# Altium project PCB_Project.PrjPcb (part 1 of 2)
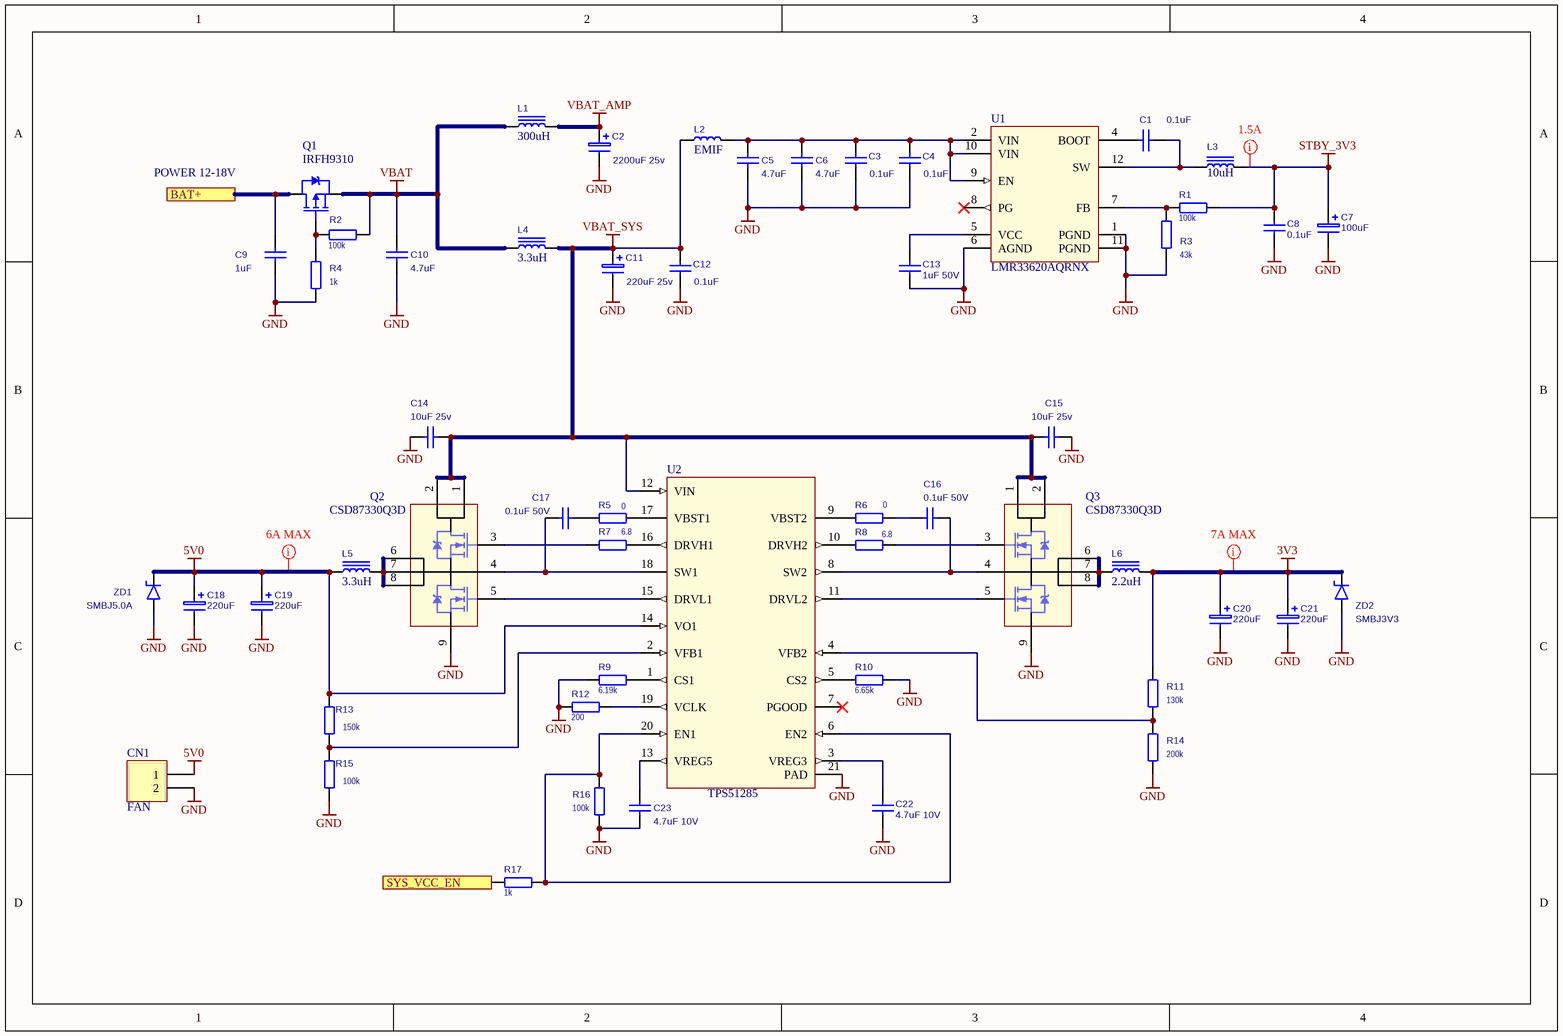
[diagram p0: power_supply.SchDoc]
8 sheets, 446 parts. Net scope: flat (ports and power ports of the same name join across sheets).
Board file: PCB.PcbDoc
Sheets:
  power_supply.SchDoc
  usb_main_connector.SchDoc
  core_module.SchDoc
  wifi_bluetooth.SchDoc
  video_in_gps_mems.SchDoc
  audio_in_dsp_radio.SchDoc
  power_amp.SchDoc
  display_dvd_connectors.SchDoc

## Sheet power_supply.SchDoc
size A4

### Parts
C1  value 0.1uF  [C0603]  (hidden comment: C1608X7R1H104K080AA)
C2  value 2200uF 25v  [R12H05]  (hidden comment: EEU-FC1V222)
C3  value 0.1uF  [C0603]  (hidden comment: C1608X7R1H104K080AA)
C4  value 0.1uF  [C0603]  (hidden comment: C1608X7R1H104K080AA)
C5  value 4.7uF  [C0603]  (hidden comment: GRM188R61E475KE11D)
C6  value 4.7uF  [C0603]  (hidden comment: GRM188R61E475KE11D)
C7  value 100uF  [TANTAL-B-1411]  (hidden comment: 6TPE100MPB)
C8  value 0.1uF  [C0603]  (hidden comment: C1608X7R1H104K080AA)
C9  value 1uF  [C0603]  (hidden comment: CC0603KRX7R9BB105)
C10  value 4.7uF  [C0603]  (hidden comment: GRM188R61E475KE11D)
C11  value 220uF 25v  [R08H04]  (hidden comment: ECAP 220/25V 0812 105'C)
C12  value 0.1uF  [C0603]  (hidden comment: C1608X7R1H104K080AA)
C13  value 1uF 50V  [C0603]  (hidden comment: CC0603KRX7R9BB105)
C14  value 10uF 25v  [C0805]  (hidden comment: GRM21BR61E106KA73L)
C15  value 10uF 25v  [C0805]  (hidden comment: GRM21BR61E106KA73L)
C16  value 0.1uF 50V  [C0603]  (hidden comment: C1608X7R1H104K080AA)
C17  value 0.1uF 50V  [C0603]  (hidden comment: C1608X7R1H104K080AA)
C18  value 220uF  [TANTAL-D-2916]  (hidden comment: 6TPE220MI)
C19  value 220uF  [TANTAL-D-2916]  (hidden comment: 6TPE220MI)
C20  value 220uF  [TANTAL-D-2916]  (hidden comment: 6TPE220MI)
C21  value 220uF  [TANTAL-D-2916]  (hidden comment: 6TPE220MI)
C22  value 4.7uF 10V  [C0603]  (hidden comment: CL10A475KP8NNNC)
C23  value 4.7uF 10V  [C0603]  (hidden comment: CL10A475KP8NNNC)
CN1  FAN  [MW-2M]
L1  value 300uH  [IND_COIL_TH_33x18]  (hidden comment: ATCA-06-301M)
L2  value EMIF  [IND0805]  (hidden comment: BLM21PG221SN1D)
L3  value 10uH  [CDRH6D28]  (hidden comment: CDRH6D38NP-100NC)
L4  value 3.3uH  [IHLP-2525CZ]  (hidden comment: IHLP2525CZER3R3M01)
L5  value 3.3uH  [IHLP-2525CZ]  (hidden comment: IHLP2525CZER3R3M01)
L6  value 2.2uH  [IHLP-2525CZ]  (hidden comment: IHLP2525CZER2R2M01)
Q1  IRFH9310  [PQFN_5X6]
Q2  CSD87330Q3D  [SON-8-3.3X3.3]
Q3  CSD87330Q3D  [SON-8-3.3X3.3]
R1  100k  [R0603]
R2  100k  [R0603]
R3  43k  [R0603]
R4  1k  [R0603]
R5  0  [R0603]
R6  0  [R0603]
R7  value 6.8  [R0603]  (hidden comment: RES 0603 6R8 5%)
R8  value 6.8  [R0603]  (hidden comment: RES 0603 6R8 5%)
R9  6.19k  [R0603]
R10  6.65k  [R0603]
R11  130k  [R0603]
R12  200  [R0603]
R13  150k  [R0603]
R14  200k  [R0603]
R15  100k  [R0603]
R16  100k  [R0603]
R17  1k  [R0603]
U1  LMR33620AQRNX  [VQFN-HR-12]
U2  TPS51285  [WQFN-20]
ZD1  value SMBJ5.0A  [SMB]  (hidden comment: SMBJ5.0A-TR)
ZD2  SMBJ3V3  [SMB]

### Ports
BAT+, SYS_VCC_EN

### Nets
3V3: C20.1(+) C21.1(+) L6.2 R11.1 ZD2.2(K)
5V0: C18.1(+) C19.1(+) CN1.1 L5.1 R13.1 U2.14(VO1) ZD1.2(K)
GND: C2.2(-) C3.2 C4.2 C5.1 C6.1 C7.2(-) C8.2 C9.1 C10.1 C11.2(-) C12.2 C13.1 C14.1 C15.2 C18.2(-) C19.2(-) C20.2(-) C21.2(-) C22.2 C23.2 CN1.2 Q2.9(GND) Q3.9(GND) R3.2 R4.2 R9.1 R10.2 R12.1 R14.2 R15.2 R16.1 U1.1(PGND) U1.6(AGND) U1.11(PGND) U2.21(PAD) ZD1.1(A) ZD2.1(A)
STBY_3V3: C7.1(+) C8.1 L3.2 R1.2
VBAT: C10.2 L1.1 L4.1 Q1.2(S) R2.2
VBAT_AMP: C2.1(+) L1.2
VBAT_SYS: C11.1(+) C12.1 C14.2 C15.1 L2.2 L4.2 Q2.1(VIN) Q2.2 Q3.1(VIN) Q3.2 U2.12(VIN)
BAT+: C9.2 Q1.3(D) ; port BAT+
SYS_VCC_EN: R17.1 ; port SYS_VCC_EN
NetC1_1: C1.1 L3.1 U1.12(SW)
NetC1_2: C1.2 U1.4(BOOT)
NetC3_1: C3.1 C4.1 C5.2 C6.2 L2.1 U1.2(VIN) U1.9(EN) U1.10(VIN)
NetC13_2: C13.2 U1.5(VCC)
NetC16_1: C16.1 R6.1
NetC16_2: C16.2 Q3.4(TGR) U2.8(SW2)
NetC17_1: C17.1 R5.1
NetC17_2: C17.2 Q2.4(TGR) U2.18(SW1)
NetC22_1: C22.1 U2.3(VREG3)
NetC23_1: C23.1 U2.13(VREG5)
NetL5_2: L5.2 Q2.6(VSW) Q2.7(VSW) Q2.8(VSW)
NetL6_1: L6.1 Q3.6(VSW) Q3.7(VSW) Q3.8(VSW)
NetQ1_1: Q1.1(G) R2.1 R4.1
NetQ2_3: Q2.3(TG) R7.1
NetQ2_5: Q2.5(BG) U2.15(DRVL1)
NetQ3_3: Q3.3(TG) R8.1
NetQ3_5: Q3.5(BG) U2.11(DRVL2)
NetR1_1: R1.1 R3.1 U1.7(FB)
NetR5_2: R5.2 U2.17(VBST1)
NetR6_2: R6.2 U2.9(VBST2)
NetR7_2: R7.2 U2.16(DRVH1)
NetR8_2: R8.2 U2.10(DRVH2)
NetR9_2: R9.2 U2.1(CS1)
NetR10_1: R10.1 U2.5(CS2)
NetR11_2: R11.2 R14.1 U2.4(VFB2)
NetR12_2: R12.2 U2.19(VCLK)
NetR13_2: R13.2 R15.1 U2.2(VFB1)
NetR16_2: R16.2 R17.2 U2.6(EN2) U2.20(EN1)

Not connected (* = marked no-connect by the designer): U1 8(PG)*; U2 7(PGOOD)*

### Layout directives
mark named 1.5A: STBY_3V3
mark named 6A MAX: 5V0
mark named 7A MAX: 3V3

### Notes on the sheet
- POWER 12-18V

### Library data of the parts
C1 C3-C6 C8-C10 C12-C17 C22 C23 = CAP_NPOL
C2 C7 C11 C18-C21 = CAP_POL
CN1 = HDR 2: Header, 2-Pin; LatestRevisionDate: 17-Jul-2002; LatestRevisionNote: Re-released for DXP Platform.; Publisher: Altium Limited
L1 L3-L6 = IND_W_IRON
L2 = IND_WO_IRON
Q1 = P-Channel: HEXFET Power MOSFET; Value: IRFH9310
Q2 Q3 = CSD87330Q3D: Synchronous Buck NexFET™ Power Block
R1-R17 = RESISTOR: RES
  R1 R2 R15 R16: Value: 100k
  R3: Value: 43k
  R4 R17: Value: 1k
  R5 R6: Value: 0
  R9: Value: 6.19k
  R10: Value: 6.65k
  R11: Value: 130k
  R12: Value: 200
  R13: Value: 150k
  R14: Value: 200k
U1 = LMR33620-Q1: 3.8-V to 36-V, 2-A Synchronous step-down voltage converter; value: TPS54232
U2 = TPS51285: Ultra-Low Quiescent (ULQ™) Dual Synchronous Step-Down Controller with / 5V and 3.3V LDOs; value: TPS53127RG
ZD1 ZD2 = ZENNER: Zenner diode
  ZD2: Value: SMBJ3V3

## Sheet usb_main_connector.SchDoc
size A3
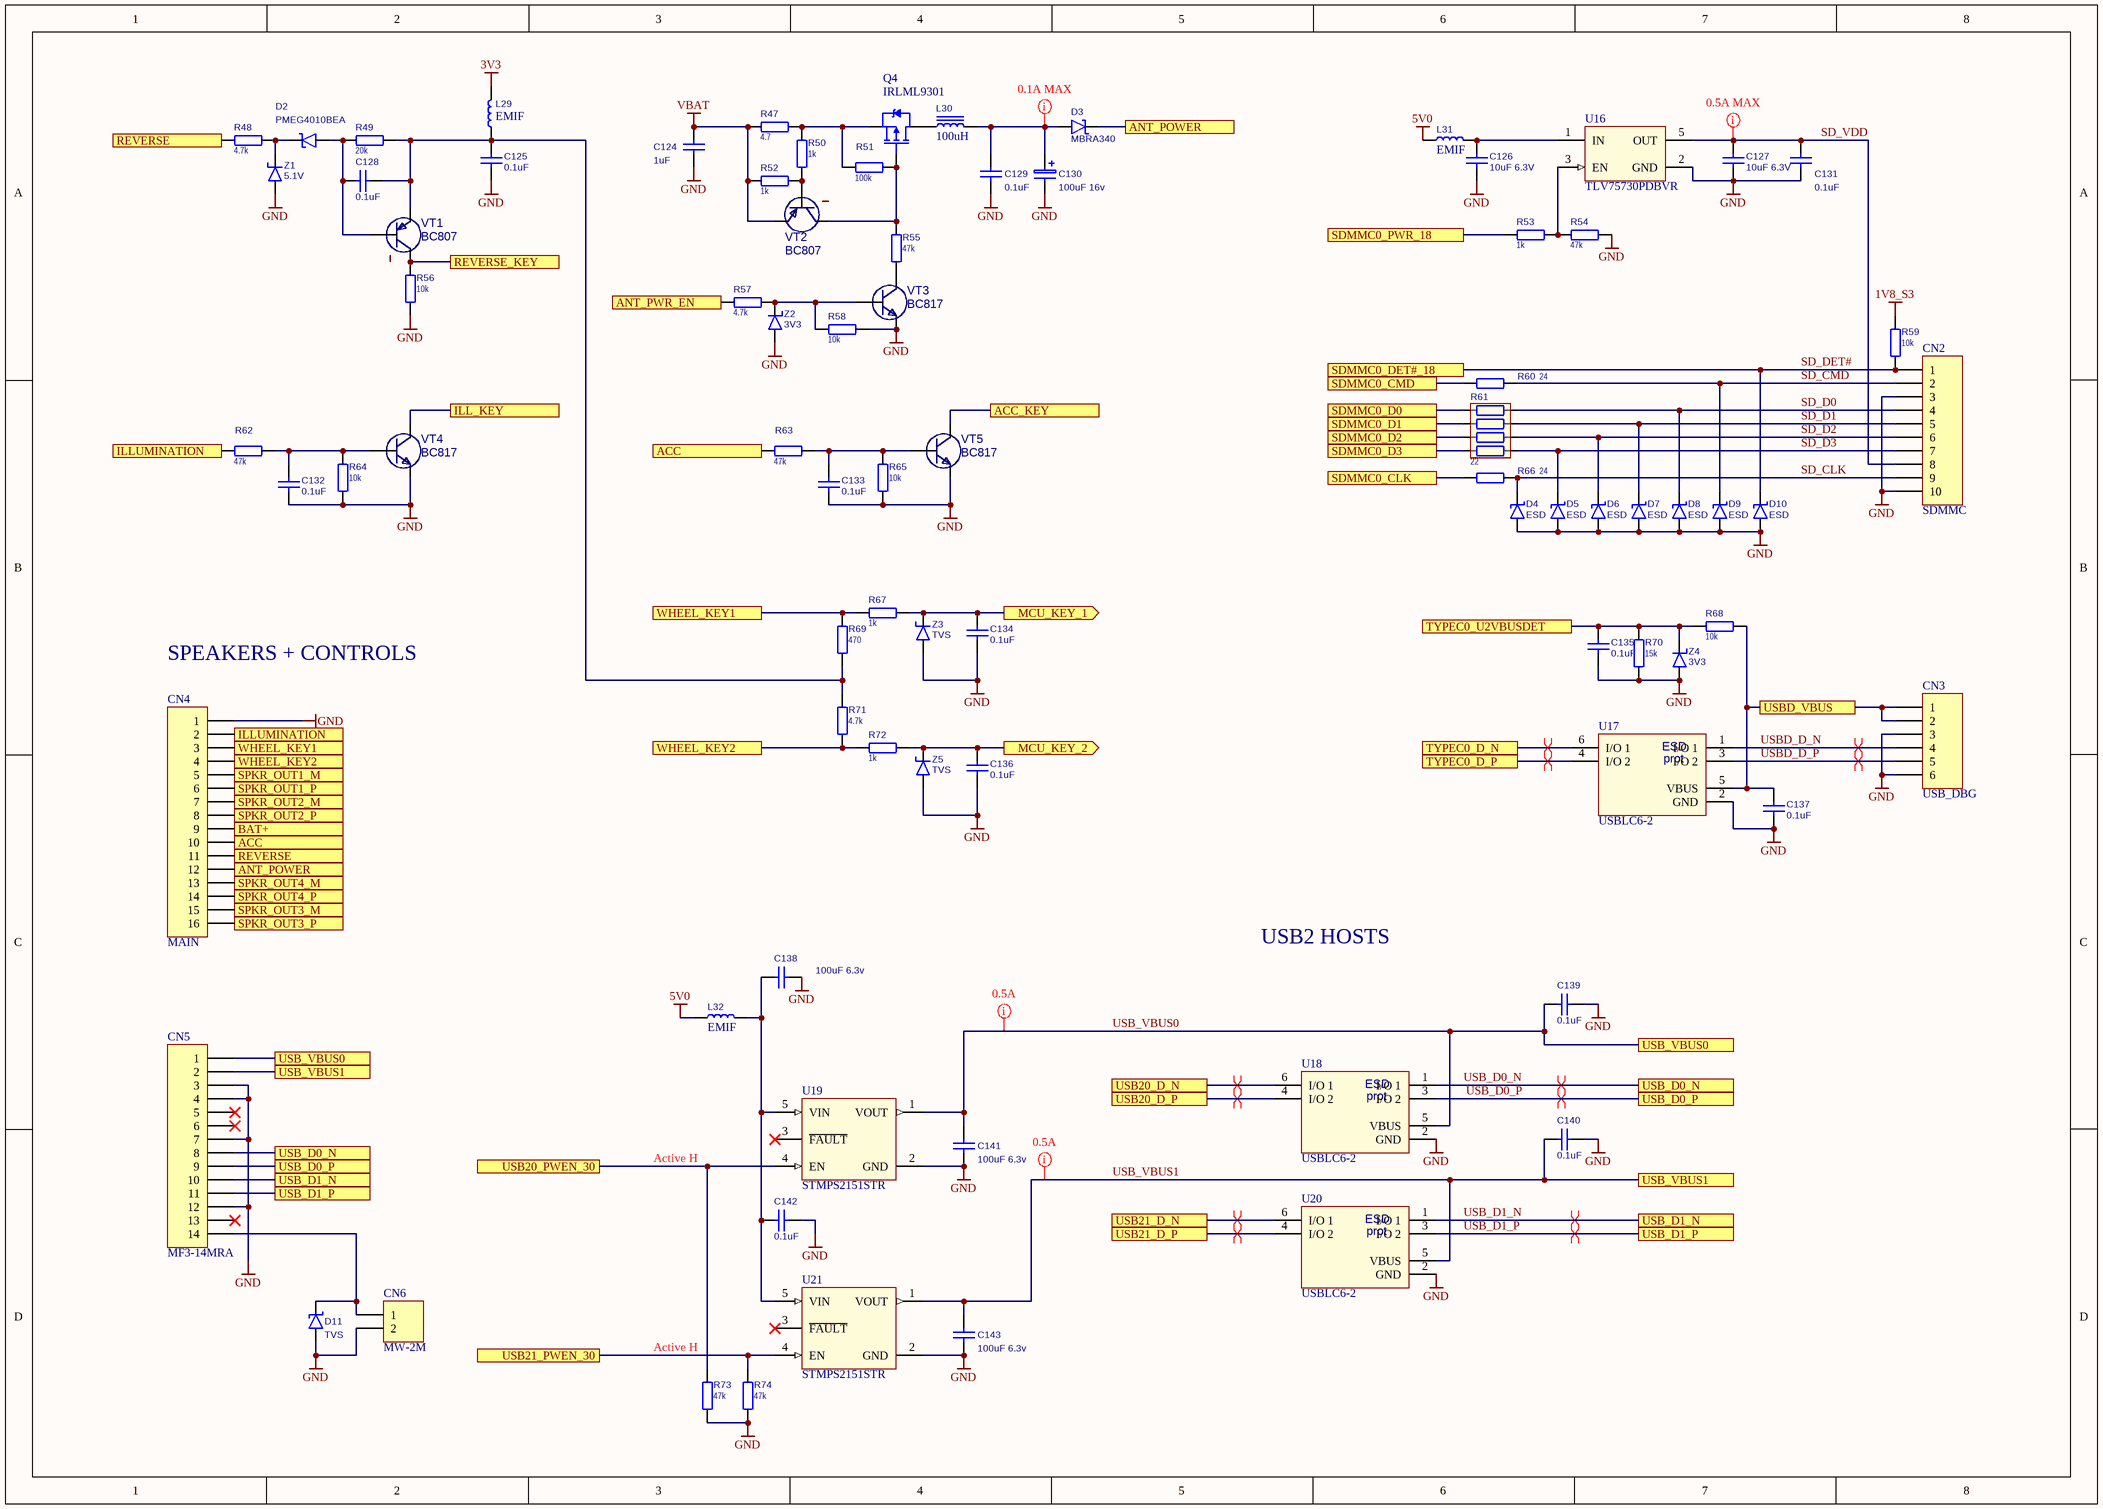
[diagram p1: usb_main_connector.SchDoc]

### Parts
C124  value 1uF  [C0603]  (hidden comment: CC0603KRX7R9BB105)
C125  value 0.1uF  [C0603]  (hidden comment: C1608X7R1H104K080AA)
C126  value 10uF 6.3V  [C0603]  (hidden comment: CC0603MRX5R5BB106)
C127  value 10uF 6.3V  [C0603]  (hidden comment: CC0603MRX5R5BB106)
C128  value 0.1uF  [C0603]  (hidden comment: C1608X7R1H104K080AA)
C129  value 0.1uF  [C0603]  (hidden comment: C1608X7R1H104K080AA)
C130  value 100uF 16v  [R05H11]  (hidden comment: ECAP 100/16V 0511 105'C)
C131  value 0.1uF  [C0603]  (hidden comment: C1608X7R1H104K080AA)
C132  value 0.1uF  [C0603]  (hidden comment: C1608X7R1H104K080AA)
C133  value 0.1uF  [C0603]  (hidden comment: C1608X7R1H104K080AA)
C134  value 0.1uF  [C0603]  (hidden comment: C1608X7R1H104K080AA)
C135  value 0.1uF  [C0603]  (hidden comment: C1608X7R1H104K080AA)
C136  value 0.1uF  [C0603]  (hidden comment: C1608X7R1H104K080AA)
C137  value 0.1uF  [C0603]  (hidden comment: C1608X7R1H104K080AA)
C138  value 100uF 6.3v  [C1206]  (hidden comment: CL31A107MQHNNNE)
C139  value 0.1uF  [C0603]  (hidden comment: C1608X7R1H104K080AA)
C140  value 0.1uF  [C0603]  (hidden comment: C1608X7R1H104K080AA)
C141  value 100uF 6.3v  [C1206]  (hidden comment: CL31A107MQHNNNE)
C142  value 0.1uF  [C0603]  (hidden comment: C1608X7R1H104K080AA)
C143  value 100uF 6.3v  [C1206]  (hidden comment: CL31A107MQHNNNE)
CN2  SDMMC  [10S-0.5SH]
CN3  USB_DBG  [6S-0.5SH]
CN4  MAIN  [43045-1600]
CN5  MF3-14MRA  [43045-1400]
CN6  MW-2M  [MW-2M]
D2  value PMEG4010BEA  [SOD-323]  (hidden comment: PMEG4010BEA.115)
D3  MBRA340  [SMA]
D4  value ESD  [SOD-923]  (hidden comment: TPD1E04U04)
D5  value ESD  [SOD-923]  (hidden comment: TPD1E04U04)
D6  value ESD  [SOD-923]  (hidden comment: TPD1E04U04)
D7  value ESD  [SOD-923]  (hidden comment: TPD1E04U04)
D8  value ESD  [SOD-923]  (hidden comment: TPD1E04U04)
D9  value ESD  [SOD-923]  (hidden comment: TPD1E04U04)
D10  value ESD  [SOD-923]  (hidden comment: TPD1E04U04)
D11  value TVS  [SOD-323]  (hidden comment: CDSOD323-T05LC)
L29  value EMIF  [IND0603]  (hidden comment: BLM18AG102SN1D)
L30  value 100uH  [CDRH4D28]  (hidden comment: CDRH4D28C/LDNP-101PC)
L31  value EMIF  [IND0603]  (hidden comment: BLM18AG102SN1D)
L32  value EMIF  [IND1206]  (hidden comment: BLM31PG391SN1L)
Q4  IRLML9301  [SOT-23-3]
R47  4.7  [R1206]
R48  4.7k  [R0603]
R49  20k  [R0603]
R50  1k  [R0603]
R51  100k  [R0603]
R52  1k  [R0603]
R53  1k  [R0603]
R54  47k  [R0603]
R55  47k  [R0603]
R56  10k  [R0603]
R57  4.7k  [R0603]
R58  10k  [R0603]
R59  10k  [R0603]
R60  24  [R0603]
R61  value 22  [R0804X4]  (hidden comment: TC124-JR-0722RL)
R62  47k  [R0603]
R63  47k  [R0603]
R64  10k  [R0603]
R65  10k  [R0603]
R66  24  [R0603]
R67  1k  [R0603]
R68  10k  [R0603]
R69  470  [R0603]
R70  15k  [R0603]
R71  4.7k  [R0603]
R72  1k  [R0603]
R73  value 47k  [R0603]  (hidden comment: 10k)
R74  value 47k  [R0603]  (hidden comment: 10k)
U16  TLV75730PDBVR  [SOT-23-5]
U17  USBLC6-2  [SOT-23-6]
U18  USBLC6-2  [SOT-23-6]
U19  STMPS2151STR  [SOT-23-5]
U20  USBLC6-2  [SOT-23-6]
U21  STMPS2151STR  [SOT-23-5]
VT1  BC807  [SOT-23-3]
VT2  BC807  [SOT-23-3]
VT3  BC817  [SOT-23-3]
VT4  BC817  [SOT-23-3]
VT5  BC817  [SOT-23-3]
Z1  value 5.1V  [SOD-323]  (hidden comment: BZX384-C5V1.115)
Z2  value 3V3  [SOD-323]  (hidden comment: BZX384-C3V3.115)
Z3  value TVS  [SOD-323]  (hidden comment: CDSOD323-T05LC)
Z4  value 3V3  [SOD-323]  (hidden comment: BZX384-C3V3.115)
Z5  value TVS  [SOD-323]  (hidden comment: CDSOD323-T05LC)

### Ports
ACC, ACC_KEY, ANT_POWER, ANT_PWR_EN, BAT+, ILL_KEY, ILLUMINATION, MCU_KEY_1 (out), MCU_KEY_2 (out), REVERSE, REVERSE_KEY, SDMMC0_CLK, SDMMC0_CMD, SDMMC0_D0, SDMMC0_D1, SDMMC0_D2, SDMMC0_D3, SDMMC0_DET#_18, SDMMC0_PWR_18, SPKR_OUT1_M, SPKR_OUT1_P, SPKR_OUT2_M, SPKR_OUT2_P, SPKR_OUT3_M, SPKR_OUT3_P, SPKR_OUT4_M, SPKR_OUT4_P, TYPEC0_D_N, TYPEC0_D_P, TYPEC0_U2VBUSDET, USB20_D_N, USB20_D_P, USB20_PWEN_30, USB21_D_N, USB21_D_P, USB21_PWEN_30, USB_D0_N, USB_D0_P, USB_D1_N, USB_D1_P, USB_VBUS0, USB_VBUS1, USBD_VBUS, WHEEL_KEY1, WHEEL_KEY2

### Nets
1V8_S3: R59.2
3V3: L29.2
5V0: L31.1 L32.2
GND: C124.1 C125.1 C126.2 C127.2 C129.1 C130.2(-) C131.1 C132.2 C133.2 C134.2 C135.2 C136.2 C137.2 C138.1 C139.2 C140.2 C141.1 C142.2 C143.1 CN2.3 CN2.10 CN3.3 CN3.6 CN4.1 CN5.3 CN5.4 CN5.7 CN5.12 CN6.2 D4.1(A) D5.1(A) D6.1(A) D7.1(A) D8.1(A) D9.1(A) D10.1(A) D11.1(A) R54.2 R56.2 R58.1 R64.1 R65.1 R70.1 R73.2 R74.2 U16.2(GND) U17.2(GND) U18.2(GND) U19.2(GND) U20.2(GND) U21.2(GND) VT3.2 VT4.2 VT5.2 Z1.1(A) Z2.1(A) Z3.1(A) Z4.1(A) Z5.1(A)
VBAT: C124.2 R47.2 R52.2 VT2.2(E)
ACC: CN4.10 R63.1 ; port ACC
ACC_KEY: VT5.3 ; port ACC_KEY
ANT_POWER: CN4.12 D3.2(K) ; port ANT_POWER
ANT_PWR_EN: R57.2 ; port ANT_PWR_EN
BAT+: CN4.9 ; port BAT+
ILL_KEY: VT4.3 ; port ILL_KEY
ILLUMINATION: CN4.2 R62.1 ; port ILLUMINATION
MCU_KEY_1: C134.1 R67.2 Z3.2(K) ; port MCU_KEY_1
MCU_KEY_2: C136.1 R72.2 Z5.2(K) ; port MCU_KEY_2
REVERSE: CN4.11 R48.1 ; port REVERSE
REVERSE_KEY: R56.1 VT1.3 ; port REVERSE_KEY
SD_CLK: CN2.9 D4.2(K) R66.1
SD_CMD: CN2.2 D9.2(K) R60.1
SD_D0: CN2.4 D8.2(K) R61.7
SD_D1: CN2.5 D7.2(K) R61.5
SD_D2: CN2.6 D6.2(K) R61.3
SD_D3: CN2.7 D5.2(K) R61.1
SD_DET#: CN2.1 D10.2(K) R59.1 ; port SDMMC0_DET#_18
SD_VDD: C127.1 C131.2 CN2.8 U16.5(OUT)
SDMMC0_CLK: R66.2 ; port SDMMC0_CLK
SDMMC0_CMD: R60.2 ; port SDMMC0_CMD
SDMMC0_D0: R61.8 ; port SDMMC0_D0
SDMMC0_D1: R61.6 ; port SDMMC0_D1
SDMMC0_D2: R61.4 ; port SDMMC0_D2
SDMMC0_D3: R61.2 ; port SDMMC0_D3
SDMMC0_PWR_18: R53.1 ; port SDMMC0_PWR_18
SPKR_OUT1_M: CN4.5 ; port SPKR_OUT1_M
SPKR_OUT1_P: CN4.6 ; port SPKR_OUT1_P
SPKR_OUT2_M: CN4.7 ; port SPKR_OUT2_M
SPKR_OUT2_P: CN4.8 ; port SPKR_OUT2_P
SPKR_OUT3_M: CN4.15 ; port SPKR_OUT3_M
SPKR_OUT3_P: CN4.16 ; port SPKR_OUT3_P
SPKR_OUT4_M: CN4.13 ; port SPKR_OUT4_M
SPKR_OUT4_P: CN4.14 ; port SPKR_OUT4_P
TYPEC0_D_N: U17.6(I/O_1) ; port TYPEC0_D_N
TYPEC0_D_P: U17.4(I/O_2) ; port TYPEC0_D_P
TYPEC0_U2VBUSDET: C135.1 R68.2 R70.2 Z4.2(K) ; port TYPEC0_U2VBUSDET
USB20_D_N: U18.6(I/O_1) ; port USB20_D_N
USB20_D_P: U18.4(I/O_2) ; port USB20_D_P
USB20_PWEN_30: R73.1 U19.4(EN) ; port USB20_PWEN_30
USB21_D_N: U20.6(I/O_1) ; port USB21_D_N
USB21_D_P: U20.4(I/O_2) ; port USB21_D_P
USB21_PWEN_30: R74.1 U21.4(EN) ; port USB21_PWEN_30
USB_D0_N: CN5.8 U18.1(I/O_1) ; port USB_D0_N
USB_D0_P: CN5.9 U18.3(I/O_2) ; port USB_D0_P
USB_D1_N: CN5.10 U20.1(I/O_1) ; port USB_D1_N
USB_D1_P: CN5.11 U20.3(I/O_2) ; port USB_D1_P
USB_VBUS0: C139.1 C141.2 CN5.1 U18.5(VBUS) U19.1(VOUT) ; port USB_VBUS0
USB_VBUS1: C140.1 C143.2 CN5.2 U20.5(VBUS) U21.1(VOUT) ; port USB_VBUS1
USBD_D_N: CN3.4 U17.1(I/O_1)
USBD_D_P: CN3.5 U17.3(I/O_2)
USBD_VBUS: C137.1 CN3.1 CN3.2 R68.1 U17.5(VBUS) ; port USBD_VBUS
WHEEL_KEY1: CN4.3 R67.1 R69.1 ; port WHEEL_KEY1
WHEEL_KEY2: CN4.4 R71.2 R72.1 ; port WHEEL_KEY2
NetC125_2: C125.2 C128.1 L29.1 R49.2 R69.2 R71.1 VT1.2
NetC126_1: C126.1 L31.2 U16.1(IN)
NetC128_2: C128.2 D2.1(A) R49.1 VT1.1
NetC129_2: C129.2 C130.1(+) D3.1(A) L30.2
NetC132_1: C132.1 R62.2 R64.2 VT4.1
NetC133_1: C133.1 R63.2 R65.2 VT5.1
NetC138_2: C138.2 C142.1 L32.1 U19.5(VIN) U21.5(VIN)
NetCN5_14: CN5.14 CN6.1 D11.2(K)
NetD2_2: D2.2(K) R48.2 Z1.2(K)
NetL30_1: L30.1 Q4.3(D)
NetQ4_1: Q4.1(G) R51.2 R55.2 VT2.3(K)
NetQ4_2: Q4.2(S) R47.1 R50.1 R51.1
NetR50_2: R50.2 R52.1 VT2.1(B)
NetR53_2: R53.2 R54.1 U16.3(EN)
NetR55_1: R55.1 VT3.3
NetR57_1: R57.1 R58.2 VT3.1 Z2.2(K)

Not connected (* = marked no-connect by the designer): CN5 5* 6* 13*; U19 3(~{FAULT})*; U21 3(~{FAULT})*

### Layout directives
mark named 0.1A MAX: NetC129_2
differential pair: TYPEC0_D_N, TYPEC0_D_P, USB20_D_N, USB20_D_P, USB21_D_N, USB21_D_P, USB_D0_N, USB_D0_P, USB_D1_N, USB_D1_P, USBD_D_N, USBD_D_P
mark named 0.5A: USB_VBUS0, USB_VBUS1
mark named 0.5A MAX: SD_VDD

### Notes on the sheet
- SPEAKERS + CONTROLS
- USB2 HOSTS
- Active H
- (near R73) Active H
- (in symbol USBLC6-2) ESD; prot

### Library data of the parts
C124-C129 C131-C143 = CAP_NPOL
C130 = CAP_POL
CN2 = HDR 10: Header, 10-Pin; LatestRevisionDate: 17-Jul-2002; LatestRevisionNote: Re-released for DXP Platform.; Publisher: Altium Limited
CN3 = HDR 6: Header, 6-Pin; LatestRevisionDate: 17-Jul-2002; LatestRevisionNote: Re-released for DXP Platform.; Publisher: Altium Limited
CN4 = HDR 16: Header, 16-Pin; LatestRevisionDate: 17-Jul-2002; LatestRevisionNote: Re-released for DXP Platform.; Publisher: Altium Limited
CN5 = HDR 14: Header, 14-Pin; LatestRevisionDate: 17-Jul-2002; LatestRevisionNote: Re-released for DXP Platform.; Publisher: Altium Limited
CN6 = HDR 2: Header, 2-Pin; LatestRevisionDate: 17-Jul-2002; LatestRevisionNote: Re-released for DXP Platform.; Publisher: Altium Limited
D2-D11 = SHOTTKY
  D3: Value: MBRA340
L29 L31 L32 = IND_WO_IRON
L30 = IND_W_IRON
Q4 = P-Channel: HEXFET Power MOSFET
R47-R60 R62-R74 = RESISTOR: RES
  R47: Value: 4.7
  R48 R57 R71: Value: 4.7k
  R49: Value: 20k
  R50 R52 R53 R67 R72: Value: 1k
  R51: Value: 100k
  R54 R55 R62 R63: Value: 47k
  R56 R58 R59 R64 R65 R68: Value: 10k
  R60 R66: Value: 24
  R69: Value: 470
  R70: Value: 15k
R61 = ARRAY
U16 = TLV733P: Capacitor-Free, 300-mA, Low-Dropout Regulator with Foldback Current Limit for Portable Devices; value: TLV733P
U17 U18 U20 = USBLC6-2: Ultralow capacitance ESD protection; value: USBLC6-2
U19 U21 = STMPS21x1STR: value: STMPS21x1STR
VT1 VT2 = P-N-P: Bipolar transistor P-N-P; Value: BC807
VT3-VT5 = N-P-N: Bipolar transistor N-P-N; Value: BC817
Z1-Z5 = ZENNER_1: ZENNER

## Sheet core_module.SchDoc
size A3
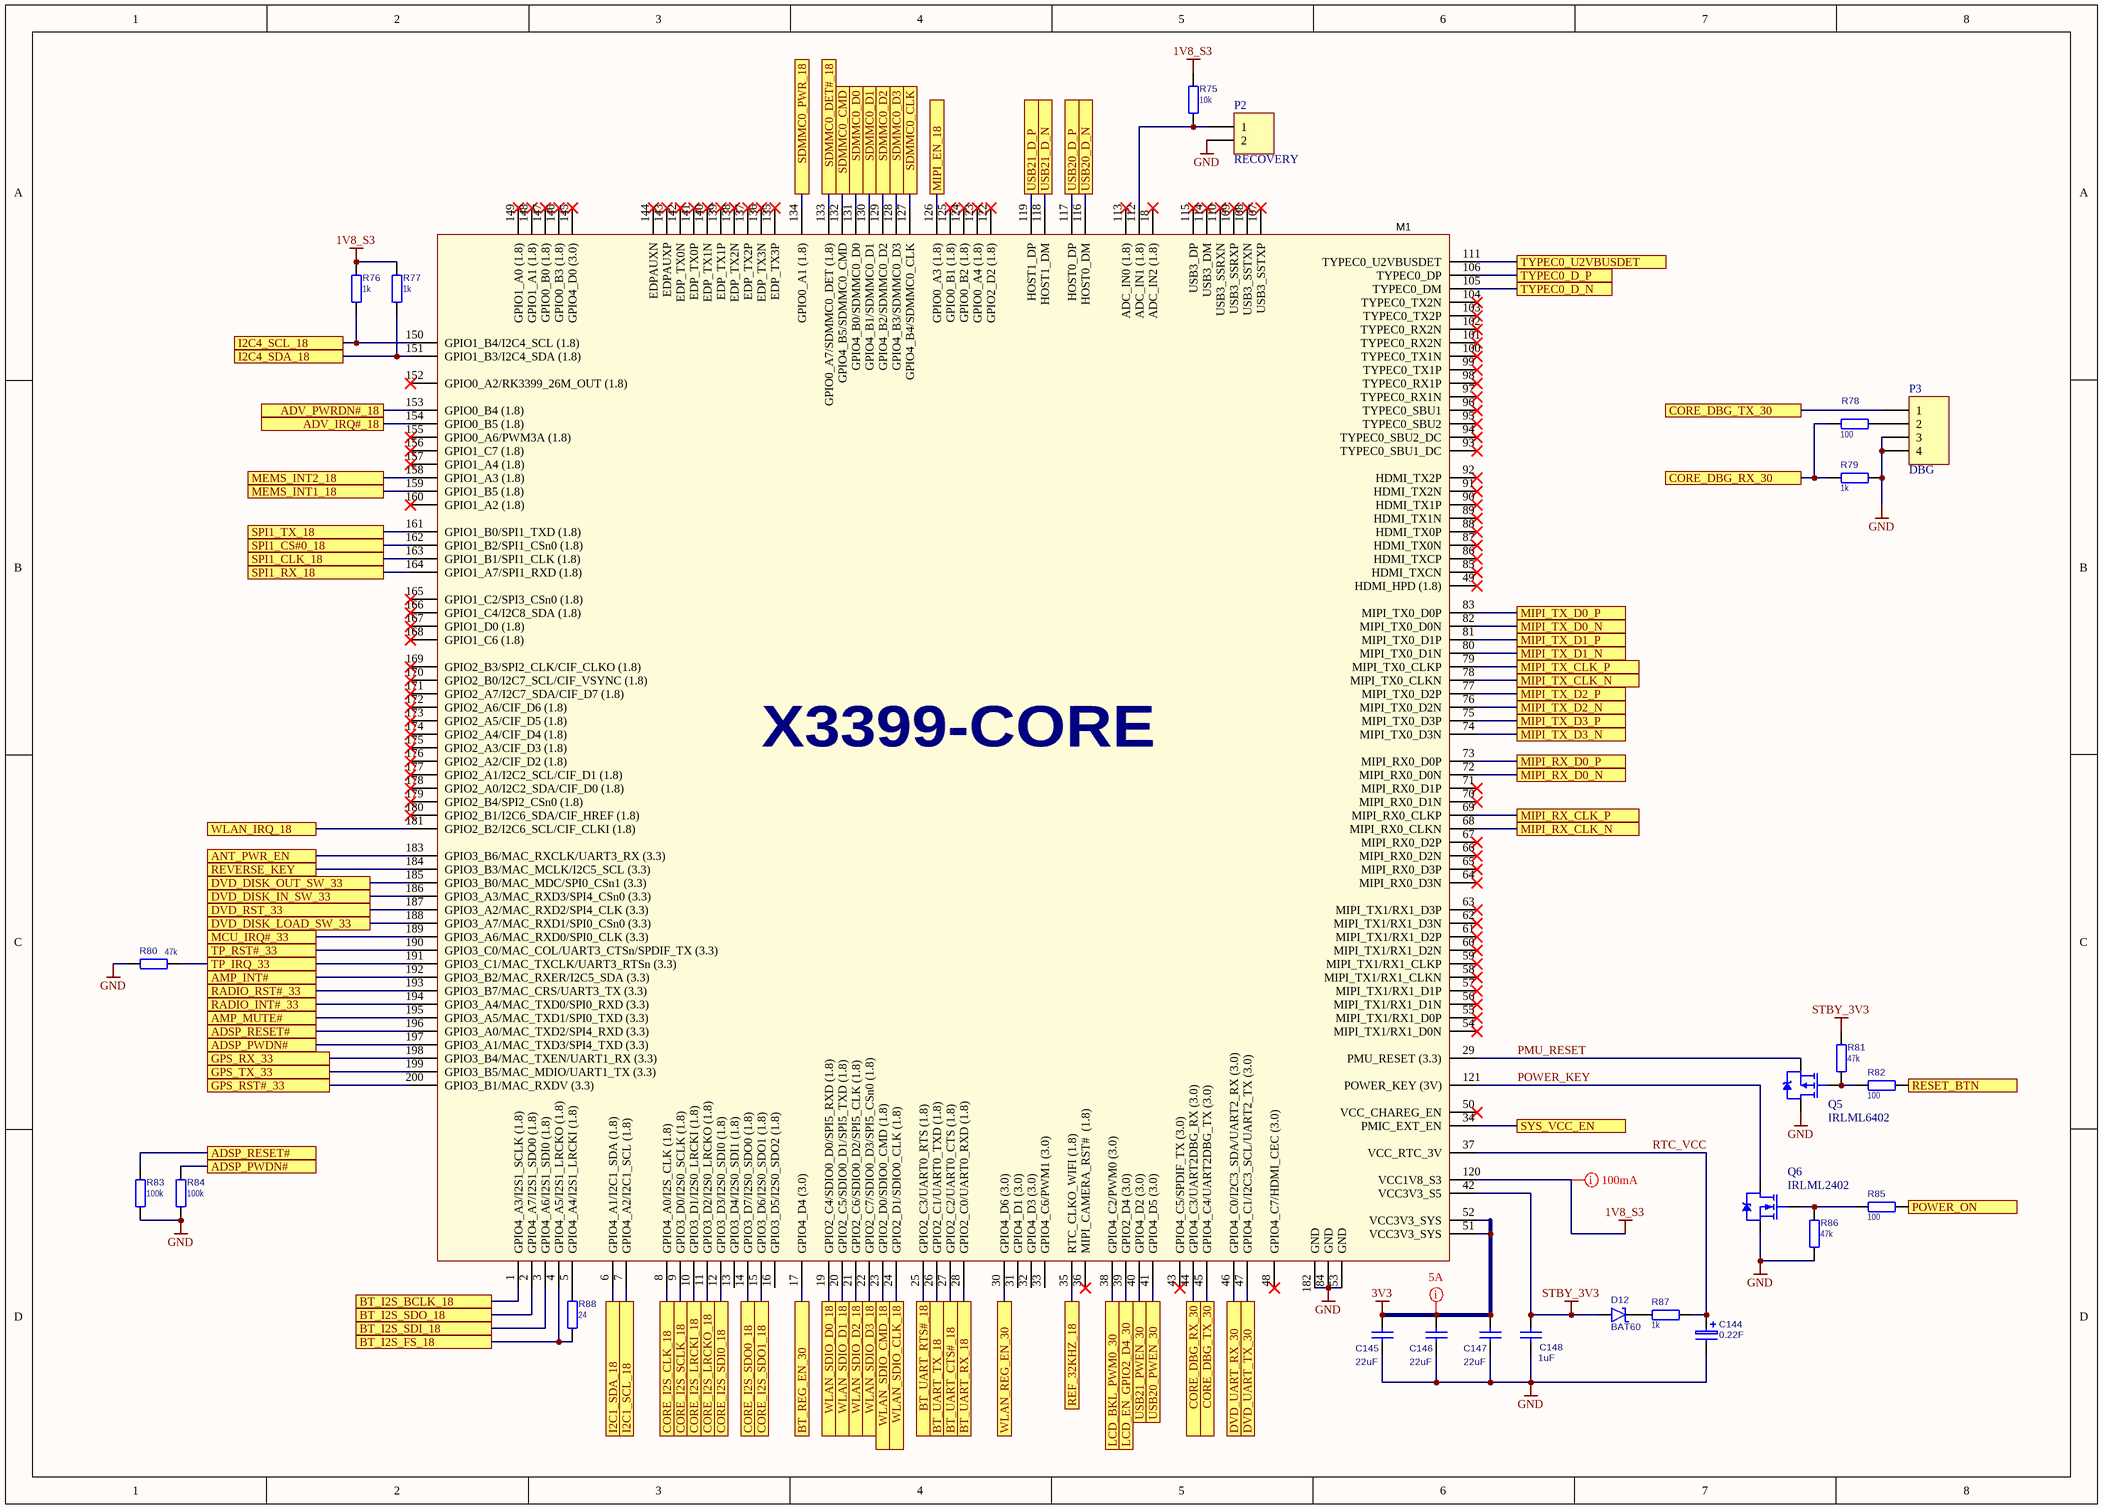
[diagram p2: core_module.SchDoc]

### Parts
C144  0.22F  [DS/DSK]
C145  value 22uF  [C0805]  (hidden comment: CL21A226MQQNNNE)
C146  value 22uF  [C0805]  (hidden comment: CL21A226MQQNNNE)
C147  value 22uF  [C0805]  (hidden comment: CL21A226MQQNNNE)
C148  value 1uF  [C0603]  (hidden comment: CC0603KRX7R9BB105)
D12  value BAT60  [SOD-323]  (hidden comment: BAT60AE6327HTSA1)
M1  X3399-CORE  [X3399-CORE]  (value not drawn)
P2  RECOVERY  [PLS-2]
P3  DBG  [PLD-2]
Q5  IRLML6402  [SOT-23-3]
Q6  IRLML2402  [SOT-23-3]
R75  10k  [R0603]
R76  1k  [R0603]
R77  1k  [R0603]
R78  100  [R0603]
R79  1k  [R0603]
R80  47k  [R0603]
R81  47k  [R0603]
R82  100  [R0603]
R83  100k  [R0603]
R84  100k  [R0603]
R85  100  [R0603]
R86  47k  [R0603]
R87  1k  [R0603]
R88  24  [R0603]

### Ports
ADSP_PWDN#, ADSP_RESET#, ADV_IRQ#_18, ADV_PWRDN#_18, AMP_INT#, AMP_MUTE#, ANT_PWR_EN, BT_I2S_BCLK_18, BT_I2S_FS_18, BT_I2S_SDI_18, BT_I2S_SDO_18, BT_REG_EN_30, BT_UART_CTS#_18, BT_UART_RTS#_18, BT_UART_RX_18, BT_UART_TX_18, CORE_DBG_RX_30, CORE_DBG_TX_30, CORE_I2S_CLK_18, CORE_I2S_LRCKI_18, CORE_I2S_LRCKO_18, CORE_I2S_SCLK_18, CORE_I2S_SDI0_18, CORE_I2S_SDO0_18, CORE_I2S_SDO1_18, DVD_DISK_IN_SW_33, DVD_DISK_LOAD_SW_33, DVD_DISK_OUT_SW_33, DVD_RST_33, DVD_UART_RX_30, DVD_UART_TX_30, GPS_RST#_33, GPS_RX_33, GPS_TX_33, I2C1_SCL_18, I2C1_SDA_18, I2C4_SCL_18, I2C4_SDA_18, LCD_BKL_PWM0_30, LCD_EN_GPIO2_D4_30, MCU_IRQ#_33, MEMS_INT1_18, MEMS_INT2_18, MIPI_EN_18, MIPI_RX_CLK_N, MIPI_RX_CLK_P, MIPI_RX_D0_N, MIPI_RX_D0_P, MIPI_TX_CLK_N, MIPI_TX_CLK_P, MIPI_TX_D0_N, MIPI_TX_D0_P, MIPI_TX_D1_N, MIPI_TX_D1_P, MIPI_TX_D2_N, MIPI_TX_D2_P, MIPI_TX_D3_N, MIPI_TX_D3_P, POWER_ON, RADIO_INT#_33, RADIO_RST#_33, REF_32KHZ_18, RESET_BTN, REVERSE_KEY, SDMMC0_CLK, SDMMC0_CMD, SDMMC0_D0, SDMMC0_D1, SDMMC0_D2, SDMMC0_D3, SDMMC0_DET#_18, SDMMC0_PWR_18, SPI1_CLK_18, SPI1_CS#0_18, SPI1_RX_18, SPI1_TX_18, SYS_VCC_EN, TP_IRQ_33, TP_RST#_33, TYPEC0_D_N, TYPEC0_D_P, TYPEC0_U2VBUSDET, USB20_D_N, USB20_D_P, USB20_PWEN_30, USB21_D_N, USB21_D_P, USB21_PWEN_30, WLAN_IRQ_18, WLAN_REG_EN_30, WLAN_SDIO_CLK_18, WLAN_SDIO_CMD_18, WLAN_SDIO_D0_18, WLAN_SDIO_D1_18, WLAN_SDIO_D2_18, WLAN_SDIO_D3_18

### Nets
1V8_S3: M1.120(VCC1V8_S3) R75.2 R76.2 R77.1
3V3: C145.1 C146.1 C147.1 M1.51(VCC3V3_SYS) M1.52(VCC3V3_SYS)
GND: C144.2(-) C145.2 C146.2 C147.2 C148.1 M1.53(GND) M1.84(GND) M1.182(GND) P2.2 P3.3 P3.4 Q5.3(D) Q6.2(S) R79.2 R80.1 R83.2 R84.2 R86.2
STBY_3V3: C148.2 D12.1(A) M1.42(VCC3V3_S5) R81.1
ADSP_PWDN#: M1.197(GPIO3_A1/MAC_TXD3/SPI4_TXD_(3.3)) R84.1 ; port ADSP_PWDN#
ADSP_RESET#: M1.196(GPIO3_A0/MAC_TXD2/SPI4_RXD_(3.3)) R83.1 ; port ADSP_RESET#
ADV_IRQ#_18: M1.154(GPIO0_B5_(1.8)) ; port ADV_IRQ#_18
ADV_PWRDN#_18: M1.153(GPIO0_B4_(1.8)) ; port ADV_PWRDN#_18
AMP_INT#: M1.192(GPIO3_B2/MAC_RXER/I2C5_SDA_(3.3)) ; port AMP_INT#
AMP_MUTE#: M1.195(GPIO3_A5/MAC_TXD1/SPI0_TXD_(3.3)) ; port AMP_MUTE#
ANT_PWR_EN: M1.183(GPIO3_B6/MAC_RXCLK/UART3_RX_(3.3)) ; port ANT_PWR_EN
BT_I2S_BCLK_18: M1.1(GPIO4_A3/I2S1_SCLK_(1.8)) ; port BT_I2S_BCLK_18
BT_I2S_FS_18: M1.4(GPIO4_A5/I2S1_LRCKO_(1.8)) R88.2 ; port BT_I2S_FS_18
BT_I2S_SDI_18: M1.3(GPIO4_A6/I2S1_SDI0_(1.8)) ; port BT_I2S_SDI_18
BT_I2S_SDO_18: M1.2(GPIO4_A7/I2S1_SDO0_(1.8)) ; port BT_I2S_SDO_18
BT_REG_EN_30: M1.17(GPIO4_D4_(3.0)) ; port BT_REG_EN_30
BT_UART_CTS#_18: M1.27(GPIO2_C2/UART0_CTS_(1.8)) ; port BT_UART_CTS#_18
BT_UART_RTS#_18: M1.25(GPIO2_C3/UART0_RTS_(1.8)) ; port BT_UART_RTS#_18
BT_UART_RX_18: M1.28(GPIO2_C0/UART0_RXD_(1.8)) ; port BT_UART_RX_18
BT_UART_TX_18: M1.26(GPIO2_C1/UART0_TXD_(1.8)) ; port BT_UART_TX_18
CORE_DBG_RX_30: M1.44(GPIO4_C3/UART2DBG_RX_(3.0)) R78.2 R79.1 ; port CORE_DBG_RX_30
CORE_DBG_TX_30: M1.45(GPIO4_C4/UART2DBG_TX_(3.0)) P3.1 ; port CORE_DBG_TX_30
CORE_I2S_CLK_18: M1.8(GPIO4_A0/I2S_CLK_(1.8)) ; port CORE_I2S_CLK_18
CORE_I2S_LRCKI_18: M1.10(GPIO3_D1/I2S0_LRCKI_(1.8)) ; port CORE_I2S_LRCKI_18
CORE_I2S_LRCKO_18: M1.11(GPIO3_D2/I2S0_LRCKO_(1.8)) ; port CORE_I2S_LRCKO_18
CORE_I2S_SCLK_18: M1.9(GPIO3_D0/I2S0_SCLK_(1.8)) ; port CORE_I2S_SCLK_18
CORE_I2S_SDI0_18: M1.12(GPIO3_D3/I2S0_SDI0_(1.8)) ; port CORE_I2S_SDI0_18
CORE_I2S_SDO0_18: M1.14(GPIO3_D7/I2S0_SDO0_(1.8)) ; port CORE_I2S_SDO0_18
CORE_I2S_SDO1_18: M1.15(GPIO3_D6/I2S0_SDO1_(1.8)) ; port CORE_I2S_SDO1_18
DVD_DISK_IN_SW_33: M1.186(GPIO3_A3/MAC_RXD3/SPI4_CSn0_(3.3)) ; port DVD_DISK_IN_SW_33
DVD_DISK_LOAD_SW_33: M1.188(GPIO3_A7/MAC_RXD1/SPI0_CSn0_(3.3)) ; port DVD_DISK_LOAD_SW_33
DVD_DISK_OUT_SW_33: M1.185(GPIO3_B0/MAC_MDC/SPI0_CSn1_(3.3)) ; port DVD_DISK_OUT_SW_33
DVD_RST_33: M1.187(GPIO3_A2/MAC_RXD2/SPI4_CLK_(3.3)) ; port DVD_RST_33
DVD_UART_RX_30: M1.46(GPIO4_C0/I2C3_SDA/UART2_RX_(3.0)) ; port DVD_UART_RX_30
DVD_UART_TX_30: M1.47(GPIO4_C1/I2C3_SCL/UART2_TX_(3.0)) ; port DVD_UART_TX_30
GPS_RST#_33: M1.200(GPIO3_B1/MAC_RXDV_(3.3)) ; port GPS_RST#_33
GPS_RX_33: M1.198(GPIO3_B4/MAC_TXEN/UART1_RX_(3.3)) ; port GPS_RX_33
GPS_TX_33: M1.199(GPIO3_B5/MAC_MDIO/UART1_TX_(3.3)) ; port GPS_TX_33
I2C1_SCL_18: M1.7(GPIO4_A2/I2C1_SCL_(1.8)) ; port I2C1_SCL_18
I2C1_SDA_18: M1.6(GPIO4_A1/I2C1_SDA_(1.8)) ; port I2C1_SDA_18
I2C4_SCL_18: M1.150(GPIO1_B4/I2C4_SCL_(1.8)) R76.1 ; port I2C4_SCL_18
I2C4_SDA_18: M1.151(GPIO1_B3/I2C4_SDA_(1.8)) R77.2 ; port I2C4_SDA_18
LCD_BKL_PWM0_30: M1.38(GPIO4_C2/PWM0_(3.0)) ; port LCD_BKL_PWM0_30
LCD_EN_GPIO2_D4_30: M1.39(GPIO2_D4_(3.0)) ; port LCD_EN_GPIO2_D4_30
MCU_IRQ#_33: M1.189(GPIO3_A6/MAC_RXD0/SPI0_CLK_(3.3)) ; port MCU_IRQ#_33
MEMS_INT1_18: M1.159(GPIO1_B5_(1.8)) ; port MEMS_INT1_18
MEMS_INT2_18: M1.158(GPIO1_A3_(1.8)) ; port MEMS_INT2_18
MIPI_EN_18: M1.126(GPIO0_A3_(1.8)) ; port MIPI_EN_18
MIPI_RX_CLK_N: M1.68(MIPI_RX0_CLKN) ; port MIPI_RX_CLK_N
MIPI_RX_CLK_P: M1.69(MIPI_RX0_CLKP) ; port MIPI_RX_CLK_P
MIPI_RX_D0_N: M1.72(MIPI_RX0_D0N) ; port MIPI_RX_D0_N
MIPI_RX_D0_P: M1.73(MIPI_RX0_D0P) ; port MIPI_RX_D0_P
MIPI_TX_CLK_N: M1.78(MIPI_TX0_CLKN) ; port MIPI_TX_CLK_N
MIPI_TX_CLK_P: M1.79(MIPI_TX0_CLKP) ; port MIPI_TX_CLK_P
MIPI_TX_D0_N: M1.82(MIPI_TX0_D0N) ; port MIPI_TX_D0_N
MIPI_TX_D0_P: M1.83(MIPI_TX0_D0P) ; port MIPI_TX_D0_P
MIPI_TX_D1_N: M1.80(MIPI_TX0_D1N) ; port MIPI_TX_D1_N
MIPI_TX_D1_P: M1.81(MIPI_TX0_D1P) ; port MIPI_TX_D1_P
MIPI_TX_D2_N: M1.76(MIPI_TX0_D2N) ; port MIPI_TX_D2_N
MIPI_TX_D2_P: M1.77(MIPI_TX0_D2P) ; port MIPI_TX_D2_P
MIPI_TX_D3_N: M1.74(MIPI_TX0_D3N) ; port MIPI_TX_D3_N
MIPI_TX_D3_P: M1.75(MIPI_TX0_D3P) ; port MIPI_TX_D3_P
PMU_RESET: M1.29(PMU_RESET_(3.3)) Q5.2(S)
POWER_KEY: M1.121(POWER_KEY_(3V)) Q6.3(D)
POWER_ON: R85.1 ; port POWER_ON
RADIO_INT#_33: M1.194(GPIO3_A4/MAC_TXD0/SPI0_RXD_(3.3)) ; port RADIO_INT#_33
RADIO_RST#_33: M1.193(GPIO3_B7/MAC_CRS/UART3_TX_(3.3)) ; port RADIO_RST#_33
REF_32KHZ_18: M1.35(RTC_CLKO_WIFI_(1.8)) ; port REF_32KHZ_18
RESET_BTN: R82.1 ; port RESET_BTN
REVERSE_KEY: M1.184(GPIO3_B3/MAC_MCLK/I2C5_SCL_(3.3)) ; port REVERSE_KEY
RTC_VCC: C144.1(+) M1.37(VCC_RTC_3V) R87.1
SD_DET#: M1.133(GPIO0_A7/SDMMC0_DET_(1.8)) ; port SDMMC0_DET#_18
SDMMC0_CLK: M1.127(GPIO4_B4/SDMMC0_CLK) ; port SDMMC0_CLK
SDMMC0_CMD: M1.132(GPIO4_B5/SDMMC0_CMD) ; port SDMMC0_CMD
SDMMC0_D0: M1.131(GPIO4_B0/SDMMC0_D0) ; port SDMMC0_D0
SDMMC0_D1: M1.130(GPIO4_B1/SDMMC0_D1) ; port SDMMC0_D1
SDMMC0_D2: M1.129(GPIO4_B2/SDMMC0_D2) ; port SDMMC0_D2
SDMMC0_D3: M1.128(GPIO4_B3/SDMMC0_D3) ; port SDMMC0_D3
SDMMC0_PWR_18: M1.134(GPIO0_A1_(1.8)) ; port SDMMC0_PWR_18
SPI1_CLK_18: M1.163(GPIO1_B1/SPI1_CLK_(1.8)) ; port SPI1_CLK_18
SPI1_CS#0_18: M1.162(GPIO1_B2/SPI1_CSn0_(1.8)) ; port SPI1_CS#0_18
SPI1_RX_18: M1.164(GPIO1_A7/SPI1_RXD_(1.8)) ; port SPI1_RX_18
SPI1_TX_18: M1.161(GPIO1_B0/SPI1_TXD_(1.8)) ; port SPI1_TX_18
SYS_VCC_EN: M1.34(PMIC_EXT_EN) ; port SYS_VCC_EN
TP_IRQ_33: M1.191(GPIO3_C1/MAC_TXCLK/UART3_RTSn_(3.3)) R80.2 ; port TP_IRQ_33
TP_RST#_33: M1.190(GPIO3_C0/MAC_COL/UART3_CTSn/SPDIF_TX_(3.3)) ; port TP_RST#_33
TYPEC0_D_N: M1.105(TYPEC0_DM) ; port TYPEC0_D_N
TYPEC0_D_P: M1.106(TYPEC0_DP) ; port TYPEC0_D_P
TYPEC0_U2VBUSDET: M1.111(TYPEC0_U2VBUSDET) ; port TYPEC0_U2VBUSDET
USB20_D_N: M1.116(HOST0_DM) ; port USB20_D_N
USB20_D_P: M1.117(HOST0_DP) ; port USB20_D_P
USB20_PWEN_30: M1.41(GPIO4_D5_(3.0)) ; port USB20_PWEN_30
USB21_D_N: M1.118(HOST1_DM) ; port USB21_D_N
USB21_D_P: M1.119(HOST1_DP) ; port USB21_D_P
USB21_PWEN_30: M1.40(GPIO4_D2_(3.0)) ; port USB21_PWEN_30
WLAN_IRQ_18: M1.181(GPIO2_B2/I2C6_SCL/CIF_CLKI_(1.8)) ; port WLAN_IRQ_18
WLAN_REG_EN_30: M1.30(GPIO4_D6_(3.0)) ; port WLAN_REG_EN_30
WLAN_SDIO_CLK_18: M1.24(GPIO2_D1/SDIO0_CLK_(1.8)) ; port WLAN_SDIO_CLK_18
WLAN_SDIO_CMD_18: M1.23(GPIO2_D0/SDIO0_CMD_(1.8)) ; port WLAN_SDIO_CMD_18
WLAN_SDIO_D0_18: M1.19(GPIO2_C4/SDIO0_D0/SPI5_RXD_(1.8)) ; port WLAN_SDIO_D0_18
WLAN_SDIO_D1_18: M1.20(GPIO2_C5/SDIO0_D1/SPI5_TXD_(1.8)) ; port WLAN_SDIO_D1_18
WLAN_SDIO_D2_18: M1.21(GPIO2_C6/SDIO0_D2/SPI5_CLK_(1.8)) ; port WLAN_SDIO_D2_18
WLAN_SDIO_D3_18: M1.22(GPIO2_C7/SDIO0_D3/SPI5_CSn0_(1.8)) ; port WLAN_SDIO_D3_18
NetD12_2: D12.2(K) R87.2
NetM1_5: M1.5(GPIO4_A4/I2S1_LRCKI_(1.8)) R88.1
NetM1_112: M1.112(ADC_IN1_(1.8)) P2.1 R75.1
NetP3_2: P3.2 R78.1
NetQ5_1: Q5.1(G) R81.2 R82.2
NetQ6_1: Q6.1(G) R85.2 R86.1

Not connected (* = marked no-connect by the designer): M1 13(GPIO3_D4/I2S0_SDI1_(1.8)) 16(GPIO3_D5/I2S0_SDO2_(1.8)) 18(ADC_IN2_(1.8))* 31(GPIO4_D1_(3.0)) 32(GPIO4_D3_(3.0)) 33(GPIO4_C6/PWM1_(3.0)) 36(MIPI_CAMERA_RST#__(1.8))* 43(GPIO4_C5/SPDIF_TX_(3.0))* 48(GPIO4_C7/HDMI_CEC_(3.0))* 49(HDMI_HPD_(1.8))* 50(VCC_CHAREG_EN)* 54(MIPI_TX1/RX1_D0N)* 55(MIPI_TX1/RX1_D0P)* 56(MIPI_TX1/RX1_D1N)* 57(MIPI_TX1/RX1_D1P)* 58(MIPI_TX1/RX1_CLKN)* 59(MIPI_TX1/RX1_CLKP)* 60(MIPI_TX1/RX1_D2N)* 61(MIPI_TX1/RX1_D2P)* 62(MIPI_TX1/RX1_D3N)* 63(MIPI_TX1/RX1_D3P)* 64(MIPI_RX0_D3N)* 65(MIPI_RX0_D3P)* 66(MIPI_RX0_D2N)* 67(MIPI_RX0_D2P)* 70(MIPI_RX0_D1N)* 71(MIPI_RX0_D1P)* 85(HDMI_TXCN)* 86(HDMI_TXCP)* 87(HDMI_TX0N)* 88(HDMI_TX0P)* 89(HDMI_TX1N)* 90(HDMI_TX1P)* 91(HDMI_TX2N)* 92(HDMI_TX2P)* 93(TYPEC0_SBU1_DC)* 94(TYPEC0_SBU2_DC)* 95(TYPEC0_SBU2)* 96(TYPEC0_SBU1)* 97(TYPEC0_RX1N)* 98(TYPEC0_RX1P)* 99(TYPEC0_TX1P)* 100(TYPEC0_TX1N)* 101(TYPEC0_RX2N)* 102(TYPEC0_RX2N)* 103(TYPEC0_TX2P)* 104(TYPEC0_TX2N)* 107(USB3_SSTXP)* 108(USB3_SSTXN)* 109(USB3_SSRXP)* 110(USB3_SSRXN)* 113(ADC_IN0_(1.8))* 114(USB3_DM)* 115(USB3_DP)* 122(GPIO2_D2_(1.8))* 123(GPIO0_A4_(1.8))* 124(GPIO0_B2_(1.8))* 125(GPIO0_B1_(1.8))* 135(EDP_TX3P)* 136(EDP_TX3N)* 137(EDP_TX2P)* 138(EDP_TX2N)* 139(EDP_TX1P)* 140(EDP_TX1N)* 141(EDP_TX0P)* 142(EDP_TX0N)* 143(EDPAUXP)* 144(EDPAUXN)* 145(GPIO4_D0_(3.0))* 146(GPIO0_B3_(1.8))* 147(GPIO0_B0_(1.8))* 148(GPIO1_A1_(1.8))* 149(GPIO1_A0_(1.8))* 152(GPIO0_A2/RK3399_26M_OUT_(1.8))* 155(GPIO0_A6/PWM3A_(1.8))* 156(GPIO1_C7_(1.8))* 157(GPIO1_A4_(1.8))* 160(GPIO1_A2_(1.8))* 165(GPIO1_C2/SPI3_CSn0_(1.8))* 166(GPIO1_C4/I2C8_SDA_(1.8))* 167(GPIO1_D0_(1.8))* 168(GPIO1_C6_(1.8))* 169(GPIO2_B3/SPI2_CLK/CIF_CLKO_(1.8))* 170(GPIO2_B0/I2C7_SCL/CIF_VSYNC_(1.8))* 171(GPIO2_A7/I2C7_SDA/CIF_D7_(1.8))* 172(GPIO2_A6/CIF_D6_(1.8))* 173(GPIO2_A5/CIF_D5_(1.8))* 174(GPIO2_A4/CIF_D4_(1.8))* 175(GPIO2_A3/CIF_D3_(1.8))* 176(GPIO2_A2/CIF_D2_(1.8))* 177(GPIO2_A1/I2C2_SCL/CIF_D1_(1.8))* 178(GPIO2_A0/I2C2_SDA/CIF_D0_(1.8))* 179(GPIO2_B4/SPI2_CSn0_(1.8))* 180(GPIO2_B1/I2C6_SDA/CIF_HREF_(1.8))*

### Layout directives
mark named 100mA: 1V8_S3
mark named 5A: 3V3

### Library data of the parts
C144 = CAP_POL: Value: 0.22F
C145-C148 = CAP_NPOL
D12 = SHOTTKY
M1 = X3399-CORE: RK3399 Six-Core 64-bit
P2 = HDR 2: Header, 2-Pin; LatestRevisionDate: 17-Jul-2002; LatestRevisionNote: Re-released for DXP Platform.; Publisher: Altium Limited
P3 = HDR 4: Header, 4-Pin; LatestRevisionDate: 17-Jul-2002; LatestRevisionNote: Re-released for DXP Platform.; Publisher: Altium Limited
Q5 = P-Channel: HEXFET Power MOSFET
Q6 = N-Channel: HEXFET Power MOSFET
R75-R88 = RESISTOR: RES
  R75: Value: 10k
  R76 R77 R79 R87: Value: 1k
  R78 R82 R85: Value: 100
  R80 R81 R86: Value: 47k
  R83 R84: Value: 100k
  R88: Value: 24

## Sheet wifi_bluetooth.SchDoc
size A4
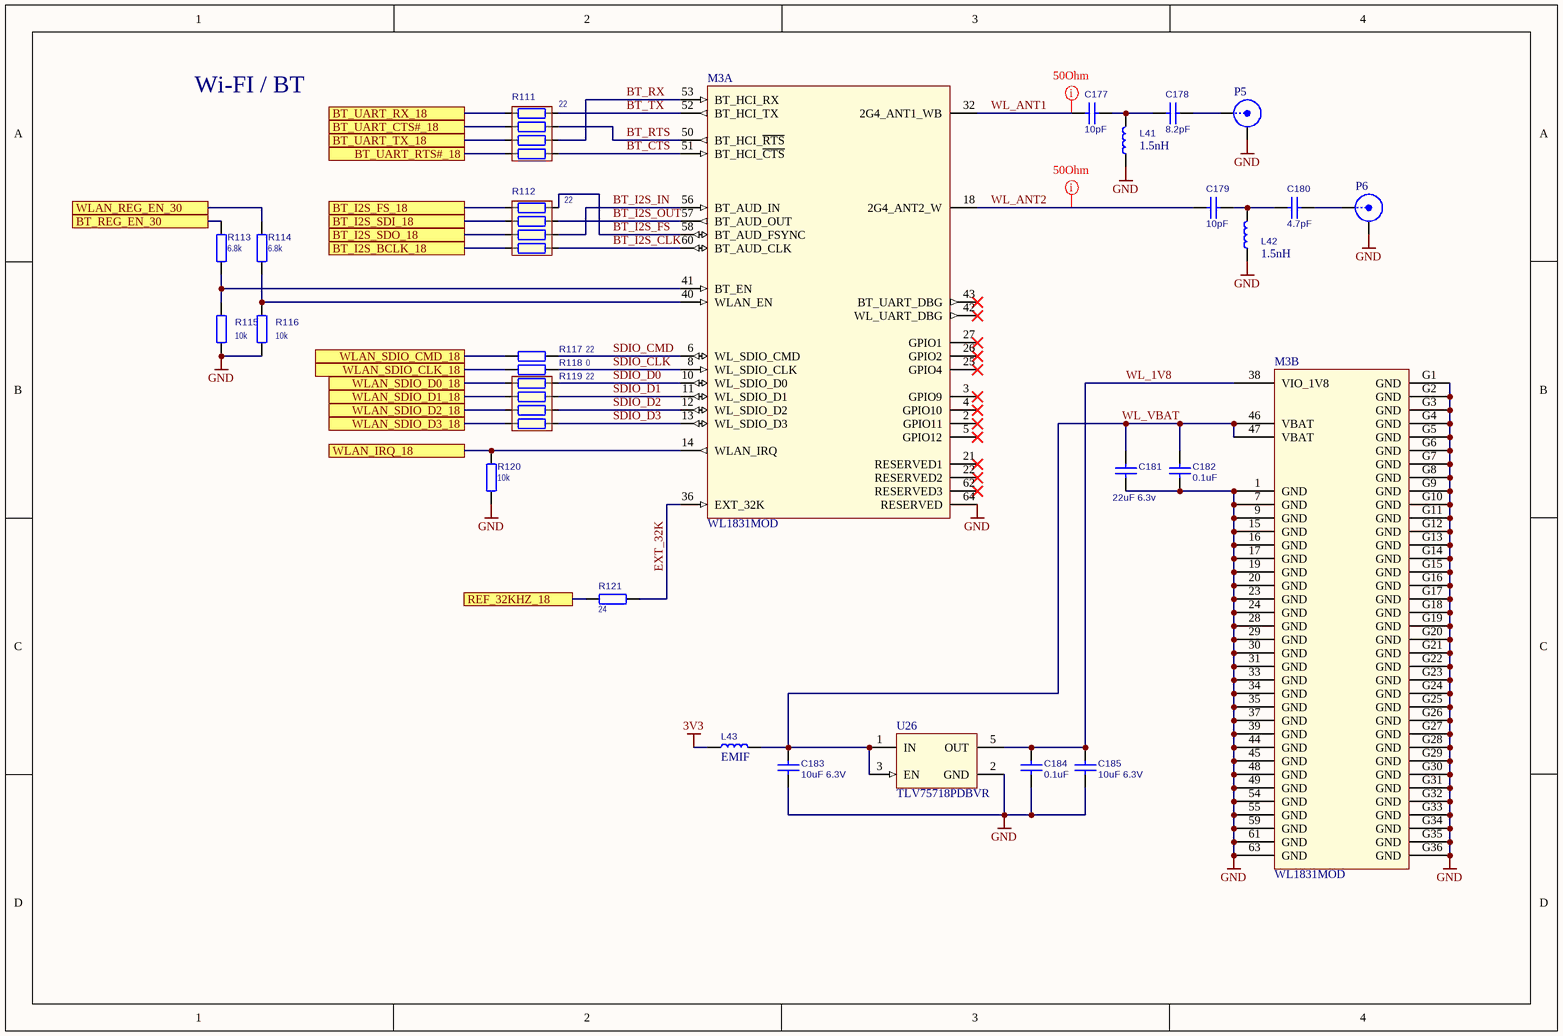
[diagram p3: wifi_bluetooth.SchDoc]

### Parts
C177  value 10pF  [C0603]  (hidden comment: CL10C100JB8NNNC)
C178  value 8.2pF  [C0603]  (hidden comment: CL10C8R2CB8NNNC)
C179  value 10pF  [C0603]  (hidden comment: CL10C100JB8NNNC)
C180  value 4.7pF  [C0603]  (hidden comment: CC0603CRNPO9BN4R7)
C181  value 22uF 6.3v  [C0805]  (hidden comment: CL21A226MQQNNNE)
C182  value 0.1uF  [C0603]  (hidden comment: C1608X7R1H104K080AA)
C183  value 10uF 6.3V  [C0603]  (hidden comment: CC0603MRX5R5BB106)
C184  value 0.1uF  [C0603]  (hidden comment: C1608X7R1H104K080AA)
C185  value 10uF 6.3V  [C0603]  (hidden comment: CC0603MRX5R5BB106)
L41  value 1.5nH  [IND0603]  (hidden comment: CLH1608T-1N5S-N)
L42  value 1.5nH  [IND0603]  (hidden comment: CLH1608T-1N5S-N)
L43  value EMIF  [IND0805]  (hidden comment: BLM21PG221SN1D)
M3  WL1831MOD  [E-13.4X13.3-N100_0.75-TOP]  (parts A,B of 2)
P5  I-PEX  [I-PEX]  (value not drawn)
P6  I-PEX  [I-PEX]  (value not drawn)
R111  value 22  [R0804X4]  (hidden comment: TC124-JR-0722RL)
R112  value 22  [R0804X4]  (hidden comment: TC124-JR-0722RL)
R113  6.8k  [R0603]
R114  6.8k  [R0603]
R115  10k  [R0603]
R116  10k  [R0603]
R117  22  [R0603]
R118  0  [R0603]
R119  value 22  [R0804X4]  (hidden comment: TC124-JR-0722RL)
R120  10k  [R0603]
R121  24  [R0603]
U26  TLV75718PDBVR  [SOT-23-5]

### Ports
BT_I2S_BCLK_18, BT_I2S_FS_18, BT_I2S_SDI_18, BT_I2S_SDO_18, BT_REG_EN_30, BT_UART_CTS#_18, BT_UART_RTS#_18, BT_UART_RX_18, BT_UART_TX_18, REF_32KHZ_18, WLAN_IRQ_18, WLAN_REG_EN_30, WLAN_SDIO_CLK_18, WLAN_SDIO_CMD_18, WLAN_SDIO_D0_18, WLAN_SDIO_D1_18, WLAN_SDIO_D2_18, WLAN_SDIO_D3_18

### Nets
3V3: L43.2
GND: C181.1 C182.1 C183.2 C184.2 C185.2 L41.1 L42.1 M3.1(GND) M3.7(GND) M3.9(GND) M3.15(GND) M3.16(GND) M3.17(GND) M3.19(GND) M3.20(GND) M3.23(GND) M3.24(GND) M3.28(GND) M3.29(GND) M3.30(GND) M3.31(GND) M3.33(GND) M3.34(GND) M3.35(GND) M3.37(GND) M3.39(GND) M3.44(GND) M3.45(GND) M3.48(GND) M3.49(GND) M3.54(GND) M3.55(GND) M3.59(GND) M3.61(GND) M3.63(GND) M3.64(RESERVED) M3.G1(GND) M3.G2(GND) M3.G3(GND) M3.G4(GND) M3.G5(GND) M3.G6(GND) M3.G7(GND) M3.G8(GND) M3.G9(GND) M3.G10(GND) M3.G11(GND) M3.G12(GND) M3.G13(GND) M3.G14(GND) M3.G15(GND) M3.G16(GND) M3.G17(GND) M3.G18(GND) M3.G19(GND) M3.G20(GND) M3.G21(GND) M3.G22(GND) M3.G23(GND) M3.G24(GND) M3.G25(GND) M3.G26(GND) M3.G27(GND) M3.G28(GND) M3.G29(GND) M3.G30(GND) M3.G31(GND) M3.G32(GND) M3.G33(GND) M3.G34(GND) M3.G35(GND) M3.G36(GND) P5.2(Y) P6.2(Y) R115.2 R116.1 R120.1 U26.2(GND)
BT_CTS: M3.51(BT_HCI_~{CTS}) R111.8
BT_I2S_BCLK_18: R112.7 ; port BT_I2S_BCLK_18
BT_I2S_CLK: M3.60(BT_AUD_CLK) R112.8
BT_I2S_FS: M3.58(BT_AUD_FSYNC) R112.2
BT_I2S_FS_18: R112.1 ; port BT_I2S_FS_18
BT_I2S_IN: M3.56(BT_AUD_IN) R112.6
BT_I2S_OUT: M3.57(BT_AUD_OUT) R112.4
BT_I2S_SDI_18: R112.3 ; port BT_I2S_SDI_18
BT_I2S_SDO_18: R112.5 ; port BT_I2S_SDO_18
BT_REG_EN_30: R113.1 ; port BT_REG_EN_30
BT_RTS: M3.50(BT_HCI_~{RTS}) R111.4
BT_RX: M3.53(BT_HCI_RX) R111.6
BT_TX: M3.52(BT_HCI_TX) R111.2
BT_UART_CTS#_18: R111.3 ; port BT_UART_CTS#_18
BT_UART_RTS#_18: R111.7 ; port BT_UART_RTS#_18
BT_UART_RX_18: R111.1 ; port BT_UART_RX_18
BT_UART_TX_18: R111.5 ; port BT_UART_TX_18
EXT_32K: M3.36(EXT_32K) R121.2
REF_32KHZ_18: R121.1 ; port REF_32KHZ_18
SDIO_CLK: M3.8(WL_SDIO_CLK) R118.1
SDIO_CMD: M3.6(WL_SDIO_CMD) R117.1
SDIO_D0: M3.10(WL_SDIO_D0) R119.1
SDIO_D1: M3.11(WL_SDIO_D1) R119.3
SDIO_D2: M3.12(WL_SDIO_D2) R119.5
SDIO_D3: M3.13(WL_SDIO_D3) R119.7
WL_1V8: C184.1 C185.1 M3.38(VIO_1V8) U26.5(OUT)
WL_ANT1: C177.1 M3.32(2G4_ANT1_WB)
WL_ANT2: C179.1 M3.18(2G4_ANT2_W)
WL_VBAT: C181.2 C182.2 C183.1 L43.1 M3.46(VBAT) M3.47(VBAT) U26.1(IN) U26.3(EN)
WLAN_IRQ_18: M3.14(WLAN_IRQ) R120.2 ; port WLAN_IRQ_18
WLAN_REG_EN_30: R114.1 ; port WLAN_REG_EN_30
WLAN_SDIO_CLK_18: R118.2 ; port WLAN_SDIO_CLK_18
WLAN_SDIO_CMD_18: R117.2 ; port WLAN_SDIO_CMD_18
WLAN_SDIO_D0_18: R119.2 ; port WLAN_SDIO_D0_18
WLAN_SDIO_D1_18: R119.4 ; port WLAN_SDIO_D1_18
WLAN_SDIO_D2_18: R119.6 ; port WLAN_SDIO_D2_18
WLAN_SDIO_D3_18: R119.8 ; port WLAN_SDIO_D3_18
NetC177_2: C177.2 C178.1 L41.2
NetC178_2: C178.2 P5.1(X)
NetC179_2: C179.2 C180.1 L42.2
NetC180_2: C180.2 P6.1(X)
NetM3_40: M3.40(WLAN_EN) R114.2 R116.2
NetM3_41: M3.41(BT_EN) R113.2 R115.1

Not connected (* = marked no-connect by the designer): M3 2(GPIO11)* 3(GPIO9)* 4(GPIO10)* 5(GPIO12)* 21(RESERVED1)* 22(RESERVED2)* 25(GPIO4)* 26(GPIO2)* 27(GPIO1)* 42(WL_UART_DBG)* 43(BT_UART_DBG)* 62(RESERVED3)*

### Layout directives
rule Undefined: WL_ANT1, WL_ANT2

### Notes on the sheet
- Wi-FI / BT

### Library data of the parts
C177-C185 = CAP_NPOL
L41-L43 = IND_WO_IRON
M3 = WL18xxMOD
P5 P6 = BNC: LatestRevisionDate: 17-Jul-2002; LatestRevisionNote: Re-released for DXP Platform.; Publisher: Altium Limited
R111 R112 R119 = ARRAY
R113-R118 R120 R121 = RESISTOR: RES
  R113 R114: Value: 6.8k
  R115 R116 R120: Value: 10k
  R117: Value: 22
  R118: Value: 0
  R121: Value: 24
U26 = TLV733P: as U16 on sheet usb_main_connector; value: TLV733P

## Sheet video_in_gps_mems.SchDoc
size A4
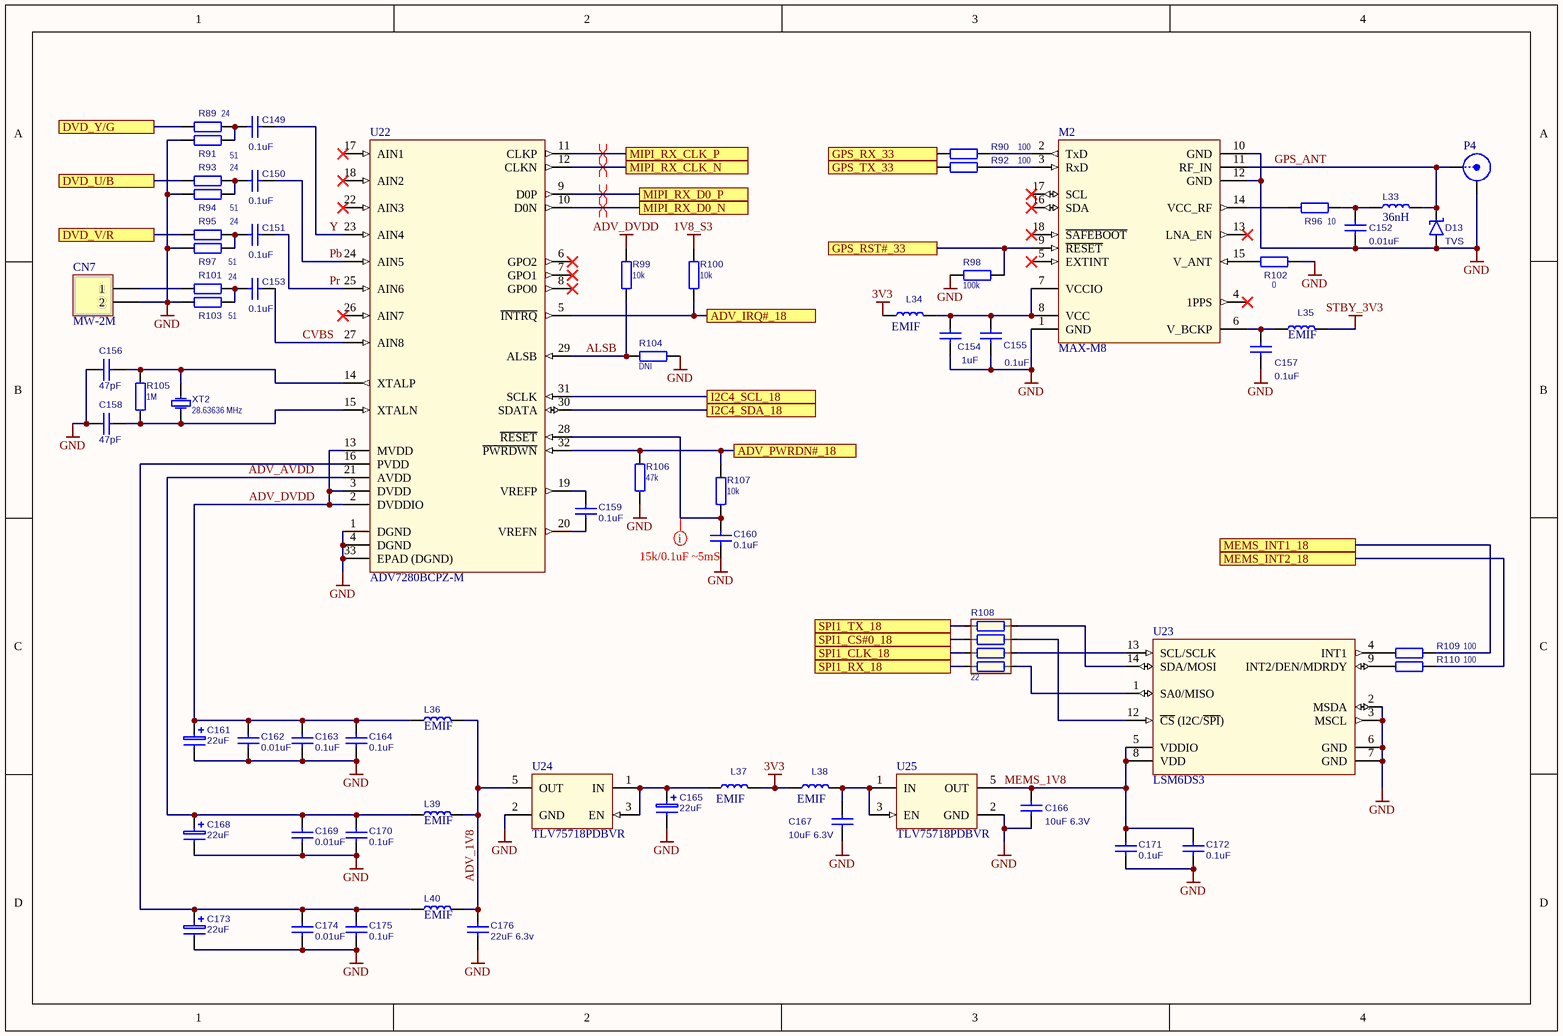
[diagram p4: video_in_gps_mems.SchDoc]

### Parts
C149  value 0.1uF  [C0603]  (hidden comment: C1608X7R1H104K080AA)
C150  value 0.1uF  [C0603]  (hidden comment: C1608X7R1H104K080AA)
C151  value 0.1uF  [C0603]  (hidden comment: C1608X7R1H104K080AA)
C152  value 0.01uF  [C0603]  (hidden comment: CL10B103KB8NNNC)
C153  value 0.1uF  [C0603]  (hidden comment: C1608X7R1H104K080AA)
C154  value 1uF  [C0603]  (hidden comment: CC0603KRX7R9BB105)
C155  value 0.1uF  [C0603]  (hidden comment: C1608X7R1H104K080AA)
C156  value 47pF  [C0603]  (hidden comment: CC0603JRNPO9BN470)
C157  value 0.1uF  [C0603]  (hidden comment: C1608X7R1H104K080AA)
C158  value 47pF  [C0603]  (hidden comment: CC0603JRNPO9BN470)
C159  value 0.1uF  [C0603]  (hidden comment: C1608X7R1H104K080AA)
C160  value 0.1uF  [C0603]  (hidden comment: C1608X7R1H104K080AA)
C161  value 22uF  [TANTAL-A-1206]  (hidden comment: 293D226X9010A2TE3)
C162  value 0.01uF  [C0603]  (hidden comment: CL10B103KB8NNNC)
C163  value 0.1uF  [C0603]  (hidden comment: C1608X7R1H104K080AA)
C164  value 0.1uF  [C0603]  (hidden comment: C1608X7R1H104K080AA)
C165  value 22uF  [TANTAL-A-1206]  (hidden comment: 293D226X9010A2TE3)
C166  value 10uF 6.3V  [C0603]  (hidden comment: CC0603MRX5R5BB106)
C167  value 10uF 6.3V  [C0603]  (hidden comment: CC0603MRX5R5BB106)
C168  value 22uF  [TANTAL-A-1206]  (hidden comment: 293D226X9010A2TE3)
C169  value 0.01uF  [C0603]  (hidden comment: CL10B103KB8NNNC)
C170  value 0.1uF  [C0603]  (hidden comment: C1608X7R1H104K080AA)
C171  value 0.1uF  [C0603]  (hidden comment: C1608X7R1H104K080AA)
C172  value 0.1uF  [C0603]  (hidden comment: C1608X7R1H104K080AA)
C173  value 22uF  [TANTAL-A-1206]  (hidden comment: 293D226X9010A2TE3)
C174  value 0.01uF  [C0603]  (hidden comment: CL10B103KB8NNNC)
C175  value 0.1uF  [C0603]  (hidden comment: C1608X7R1H104K080AA)
C176  value 22uF 6.3v  [C0805]  (hidden comment: CL21A226MQQNNNE)
CN7  MW-2M  [MW-2M]
D13  value TVS  [SOD-323]  (hidden comment: CDSOD323-T05LC)
L33  value 36nH  [IND0603]  (hidden comment: LQW18AN36NG00D)
L34  value EMIF  [IND0603]  (hidden comment: BLM18AG102SN1D)
L35  value EMIF  [IND0603]  (hidden comment: BLM18AG102SN1D)
L36  value EMIF  [IND0603]  (hidden comment: BLM18AG102SN1D)
L37  value EMIF  [IND0603]  (hidden comment: BLM18AG102SN1D)
L38  value EMIF  [IND0603]  (hidden comment: BLM18AG102SN1D)
L39  value EMIF  [IND0603]  (hidden comment: BLM18AG102SN1D)
L40  value EMIF  [IND0603]  (hidden comment: BLM18AG102SN1D)
M2  MAX-M8  [MAX-M8]
P4  I-PEX  [I-PEX]  (value not drawn)
R89  24  [R0603]
R90  100  [R0603]
R91  51  [R0603]
R92  100  [R0603]
R93  24  [R0603]
R94  51  [R0603]
R95  24  [R0603]
R96  10  [R0603]
R97  51  [R0603]
R98  100k  [R0603]
R99  10k  [R0603]
R100  10k  [R0603]
R101  24  [R0603]
R102  0  [R0603]
R103  51  [R0603]
R104  DNI  [R0603]
R105  1M  [R0603]
R106  47k  [R0603]
R107  10k  [R0603]
R108  value 22  [R0804X4]  (hidden comment: TC124-JR-0722RL)
R109  100  [R0603]
R110  100  [R0603]
U22  ADV7280BCPZ-M  [CP-32-12]
U23  LSM6DS3  [LGA-14 (2.5x3.0x0.86)]
U24  TLV75718PDBVR  [SOT-23-5]
U25  TLV75718PDBVR  [SOT-23-5]
XT2  28.63636 MHz  [HC-49/S-SMD]

### Ports
ADV_IRQ#_18, ADV_PWRDN#_18, DVD_U/B, DVD_V/R, DVD_Y/G, GPS_RST#_33, GPS_RX_33, GPS_TX_33, I2C4_SCL_18, I2C4_SDA_18, MEMS_INT1_18, MEMS_INT2_18, MIPI_RX_CLK_N, MIPI_RX_CLK_P, MIPI_RX_D0_N, MIPI_RX_D0_P, SPI1_CLK_18, SPI1_CS#0_18, SPI1_RX_18, SPI1_TX_18

### Nets
1V8_S3: R100.2
3V3: L34.1 L37.2 L38.1
ADV_DVDD: C161.1(+) C162.1 C163.1 C164.1 L36.1 R99.2 U22.2(DVDDIO) U22.3(DVDD) U22.13(MVDD)
GND: C152.2 C154.1 C155.2 C156.2 C157.2 C158.2 C160.2 C161.2(-) C162.2 C163.2 C164.2 C165.2(-) C166.2 C167.2 C168.2(-) C169.2 C170.2 C171.2 C172.2 C173.2(-) C174.2 C175.2 C176.1 CN7.2 D13.1(A) M2.1(GND) M2.10(GND) M2.12(GND) P4.2(Y) R91.1 R94.1 R97.1 R98.1 R102.1 R103.1 R104.1 R106.1 U22.1(DGND) U22.4(DGND) U22.33(EPAD_(DGND)) U23.2(MSDA) U23.3(MSCL) U23.6(GND) U23.7(GND) U24.2(GND) U25.2(GND)
STBY_3V3: L35.2
ADV_1V8: C176.2 L36.2 L39.2 L40.2 U24.5(OUT)
ADV_AVDD: C168.1(+) C169.1 C170.1 L39.1 U22.21(AVDD)
ADV_IRQ#_18: R100.1 U22.5(~{INTRQ}) ; port ADV_IRQ#_18
ADV_PWRDN#_18: R106.2 R107.1 U22.32(~{PWRDWN}) ; port ADV_PWRDN#_18
ALSB: R99.1 R104.2 U22.29(ALSB)
CVBS: C153.1 U22.27(AIN8)
DVD_U/B: R93.2 ; port DVD_U/B
DVD_V/R: R95.2 ; port DVD_V/R
DVD_Y/G: R89.2 ; port DVD_Y/G
GPS_ANT: D13.2(K) L33.2 M2.11(RF_IN) P4.1(X)
GPS_RST#_33: M2.9(~{RESET}) R98.2 ; port GPS_RST#_33
GPS_RX_33: R90.2 ; port GPS_RX_33
GPS_TX_33: R92.2 ; port GPS_TX_33
I2C4_SCL_18: U22.31(SCLK) ; port I2C4_SCL_18
I2C4_SDA_18: U22.30(SDATA) ; port I2C4_SDA_18
MEMS_1V8: C166.1 C171.1 C172.1 U23.5(VDDIO) U23.8(VDD) U25.5(OUT)
MEMS_INT1_18: R109.1 ; port MEMS_INT1_18
MEMS_INT2_18: R110.1 ; port MEMS_INT2_18
MIPI_RX_CLK_N: U22.12(CLKN) ; port MIPI_RX_CLK_N
MIPI_RX_CLK_P: U22.11(CLKP) ; port MIPI_RX_CLK_P
MIPI_RX_D0_N: U22.10(D0N) ; port MIPI_RX_D0_N
MIPI_RX_D0_P: U22.9(D0P) ; port MIPI_RX_D0_P
Pb: C150.1 U22.24(AIN5)
Pr: C151.1 U22.25(AIN6)
SPI1_CLK_18: R108.3 ; port SPI1_CLK_18
SPI1_CS#0_18: R108.5 ; port SPI1_CS#0_18
SPI1_RX_18: R108.1 ; port SPI1_RX_18
SPI1_TX_18: R108.7 ; port SPI1_TX_18
Y: C149.1 U22.23(AIN4)
NetC149_2: C149.2 R89.1 R91.2
NetC150_2: C150.2 R93.1 R94.2
NetC151_2: C151.2 R95.1 R97.2
NetC152_1: C152.1 L33.1 R96.1
NetC153_2: C153.2 R101.1 R103.2
NetC154_2: C154.2 C155.1 L34.2 M2.7(VCCIO) M2.8(VCC)
NetC156_1: C156.1 R105.1 U22.14(XTALP) XT2.1
NetC157_1: C157.1 L35.1 M2.6(V_BCKP)
NetC158_1: C158.1 R105.2 U22.15(XTALN) XT2.2
NetC159_1: C159.1 U22.19(VREFP)
NetC159_2: C159.2 U22.20(VREFN)
NetC160_1: C160.1 R107.2 U22.28(~{RESET})
NetC165_1: C165.1(+) L37.1 U24.1(IN) U24.3(EN)
NetC167_1: C167.1 L38.2 U25.1(IN) U25.3(EN)
NetC173_1: C173.1(+) C174.1 C175.1 L40.1 U22.16(PVDD)
NetCN7_1: CN7.1 R101.2
NetM2_2: M2.2(TxD) R90.1
NetM2_3: M2.3(RxD) R92.1
NetM2_14: M2.14(VCC_RF) R96.2
NetM2_15: M2.15(V_ANT) R102.2
NetR108_2: R108.2 U23.1(SA0/MISO)
NetR108_4: R108.4 U23.13(SCL/SCLK)
NetR108_6: R108.6 U23.12(~{CS}_(I2C/~{SPI}))
NetR108_8: R108.8 U23.14(SDA/MOSI)
NetR109_2: R109.2 U23.4(INT1)
NetR110_2: R110.2 U23.9(INT2/DEN/MDRDY)

Not connected (* = marked no-connect by the designer): M2 4(1PPS)* 5(EXTINT)* 13(LNA_EN)* 16(SDA)* 17(SCL)* 18(~{SAFEBOOT})*; U22 6(GPO2)* 7(GPO1)* 8(GPO0)* 17(AIN1)* 18(AIN2)* 22(AIN3)* 26(AIN7)*

### Layout directives
mark named 15k/0.1uF ~5mS: NetC160_1
differential pair: MIPI_RX_CLK_N, MIPI_RX_CLK_P, MIPI_RX_D0_N, MIPI_RX_D0_P

### Library data of the parts
C149-C160 C162-C164 C166 C167 C169-C172 C174-C176 = CAP_NPOL
C161 C165 C168 C173 = CAP_POL
CN7 = HDR 2: Header, 2-Pin; LatestRevisionDate: 17-Jul-2002; LatestRevisionNote: Re-released for DXP Platform.; Publisher: Altium Limited
D13 = SHOTTKY
L33-L40 = IND_WO_IRON
M2 = MAX-M8: MAX-M8 concurrent GNSS modules; value: NEO-M8
P4 = BNC: LatestRevisionDate: 17-Jul-2002; LatestRevisionNote: Re-released for DXP Platform.; Publisher: Altium Limited
R89-R107 R109 R110 = RESISTOR: RES
  R89 R93 R95 R101: Value: 24
  R90 R92 R109 R110: Value: 100
  R91 R94 R97 R103: Value: 51
  R96: Value: 10
  R98: Value: 100k
  R99 R100 R107: Value: 10k
  R102: Value: 0
  R104: Value: DNI
  R105: Value: 1M
  R106: Value: 47k
R108 = ARRAY
U22 = ADV7280BCPZ-M: 10-Bit, 4xOversampling SDTV Video Decoder; Value: ADV7280BCPZ-M
U23 = LSM6DS3: iNEMO inertial module: / always-on 3D accelerometer and 3D gyroscope; value: LSM9DS0
U24 U25 = TLV733P: as U16 on sheet usb_main_connector; value: TLV733P
XT2 = XTAL: Value: 28.63636 MHz